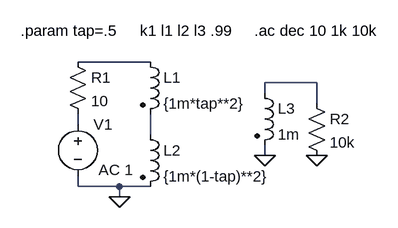
[diagram p0: schematic Tapped transformer.asc]
Tapped transformer.asc, the LTspice schematic file:
Version 4
SHEET 1 880 680
WIRE 16 112 -96 112
WIRE 272 144 192 144
WIRE 192 160 192 144
WIRE 272 176 272 144
WIRE -96 208 -96 192
WIRE 16 224 16 192
WIRE 192 256 192 240
WIRE -96 304 -96 288
WIRE -32 304 -96 304
WIRE 16 304 -32 304
WIRE -32 320 -32 304
FLAG -32 320 0
FLAG 192 256 0
FLAG 272 256 0
SYMBOL ind2 0 96 R0
SYMATTR InstName L1
SYMATTR Value {1m*tap**2}
SYMATTR Type ind
SYMBOL ind2 0 208 R0
SYMATTR InstName L2
SYMATTR Value {1m*(1-tap)**2}
SYMATTR Type ind
SYMBOL ind2 176 144 R0
SYMATTR InstName L3
SYMATTR Value 1m
SYMATTR Type ind
SYMBOL voltage -96 192 R0
WINDOW 123 32 86 Left 0
WINDOW 39 0 0 Left 0
SYMATTR Value2 AC 1
SYMATTR InstName V1
SYMATTR Value ""
SYMBOL res -112 96 R0
SYMATTR InstName R1
SYMATTR Value 10
SYMBOL res 256 160 R0
SYMATTR InstName R2
SYMATTR Value 10k
TEXT -184 64 Left 0 !.param tap=.5
TEXT 0 64 Left 0 !k1 l1 l2 l3 .99
TEXT 176 64 Left 0 !.ac dec 10 1k 10k

The netlist it stands for:
* Tapped transformer.asc
L1 N001 N004 {1m*tap**2}
L2 N004 0 {1m*(1-tap)**2}
L3 N002 0 1m
V1 N003 0 AC 1
R1 N001 N003 10
R2 N002 0 10k
.param tap=.5
k1 l1 l2 l3 .99
.ac dec 10 1k 10k
.backanno
.end